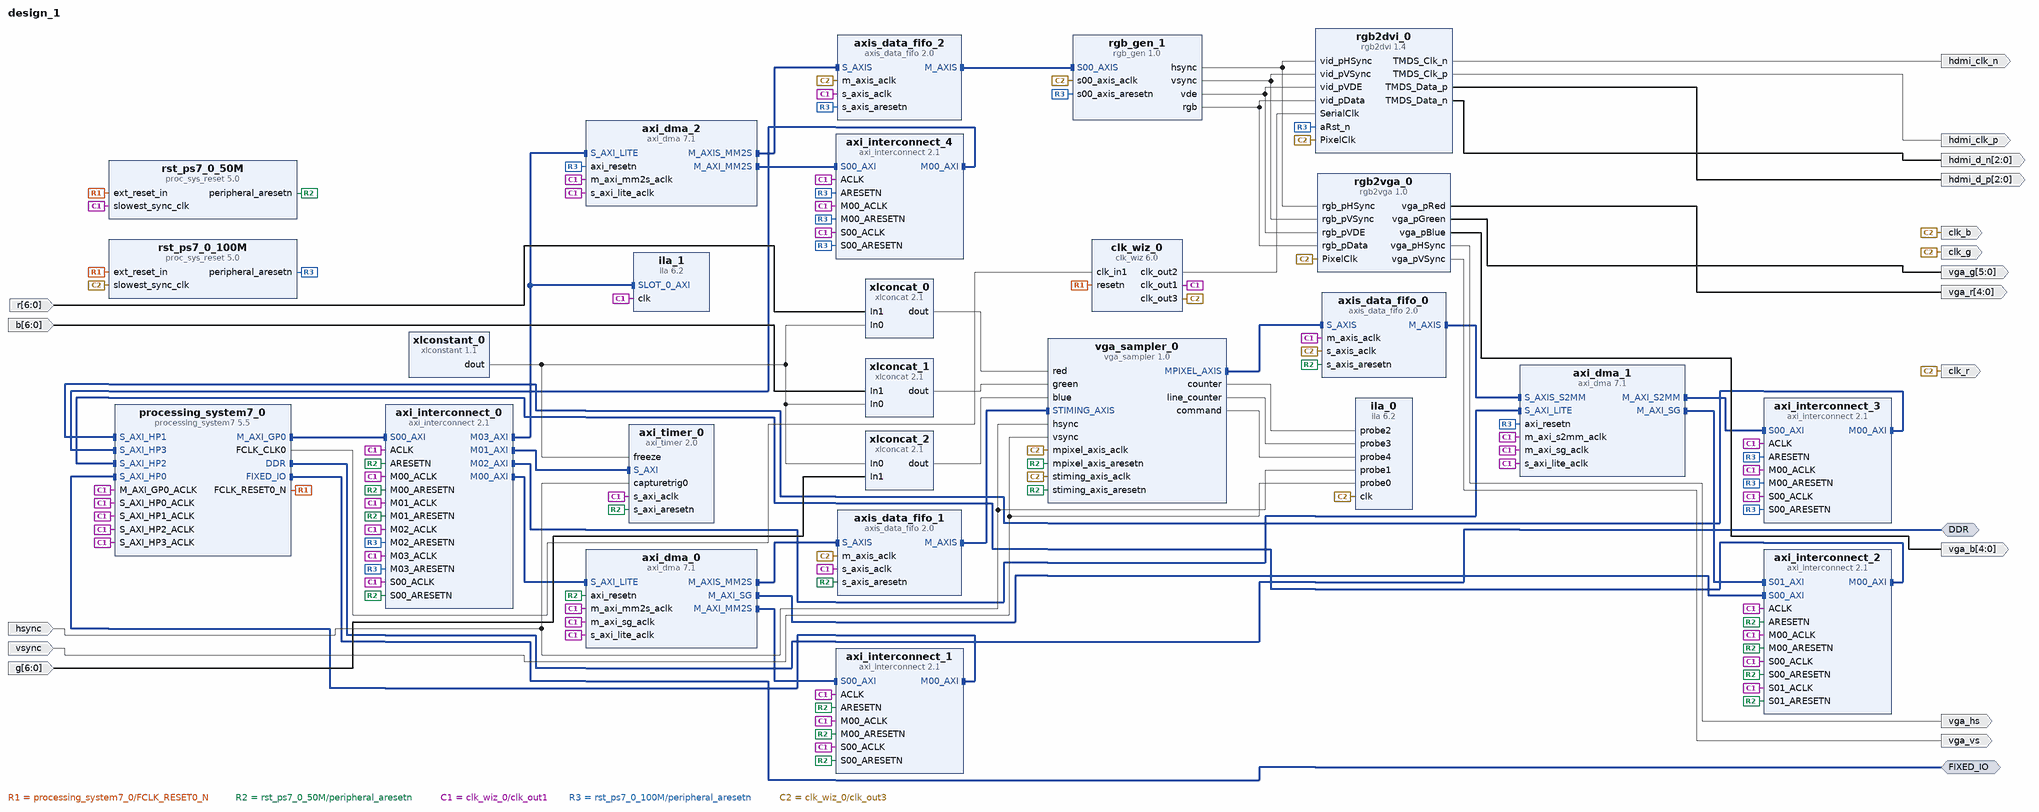
[diagram p0: block diagram of the top level]
# Vivado block design design_1, xc7z010clg400-1, Vivado 2018.3
create_bd_design design_1

create_bd_intf_port -mode Master -vlnv xilinx.com:interface:ddrx_rtl:1.0 DDR
create_bd_intf_port -mode Master -vlnv xilinx.com:display_processing_system7:fixedio_rtl:1.0 FIXED_IO
create_bd_port -dir I hsync
create_bd_port -dir I vsync
create_bd_port -dir I -from 6 -to 0 r
create_bd_port -dir I -from 6 -to 0 g
create_bd_port -dir I -from 6 -to 0 b
create_bd_port -dir O -type clk clk_r
set_property -dict {CONFIG.FREQ_HZ 25000000} [get_bd_ports clk_r]
create_bd_port -dir O -type clk clk_g
set_property -dict {CONFIG.FREQ_HZ 25000000} [get_bd_ports clk_g]
create_bd_port -dir O -type clk clk_b
set_property -dict {CONFIG.FREQ_HZ 25000000} [get_bd_ports clk_b]
create_bd_port -dir O -type clk hdmi_clk_p
create_bd_port -dir O -type clk hdmi_clk_n
create_bd_port -dir O -from 2 -to 0 hdmi_d_p
create_bd_port -dir O -from 2 -to 0 hdmi_d_n
create_bd_port -dir O -from 4 -to 0 vga_r
create_bd_port -dir O -from 5 -to 0 vga_g
create_bd_port -dir O -from 4 -to 0 vga_b
create_bd_port -dir O vga_hs
create_bd_port -dir O vga_vs

create_bd_cell -type ip -vlnv xilinx.com:ip:processing_system7:5.5 processing_system7_0
set_property -dict [list \
  CONFIG.PCW_APU_PERIPHERAL_FREQMHZ 650 \
  CONFIG.PCW_CRYSTAL_PERIPHERAL_FREQMHZ 50.000000 \
  CONFIG.PCW_ENET0_ENET0_IO {MIO 16 .. 27} \
  CONFIG.PCW_ENET0_GRP_MDIO_ENABLE 1 \
  CONFIG.PCW_ENET0_GRP_MDIO_IO {MIO 52 .. 53} \
  CONFIG.PCW_ENET0_PERIPHERAL_ENABLE 1 \
  CONFIG.PCW_ENET0_RESET_ENABLE 0 \
  CONFIG.PCW_ENET_RESET_ENABLE 1 \
  CONFIG.PCW_ENET_RESET_SELECT {Share reset pin} \
  CONFIG.PCW_FPGA0_PERIPHERAL_FREQMHZ 100 \
  CONFIG.PCW_FPGA1_PERIPHERAL_FREQMHZ 50 \
  CONFIG.PCW_GP0_EN_MODIFIABLE_TXN 0 \
  CONFIG.PCW_GP1_EN_MODIFIABLE_TXN 0 \
  CONFIG.PCW_GPIO_MIO_GPIO_ENABLE 1 \
  CONFIG.PCW_GPIO_MIO_GPIO_IO MIO \
  CONFIG.PCW_I2C_RESET_ENABLE 1 \
  CONFIG.PCW_PERIPHERAL_BOARD_PRESET part0 \
  CONFIG.PCW_PRESET_BANK1_VOLTAGE {LVCMOS 1.8V} \
  CONFIG.PCW_QSPI_GRP_FBCLK_ENABLE 1 \
  CONFIG.PCW_QSPI_GRP_FBCLK_IO {MIO 8} \
  CONFIG.PCW_QSPI_GRP_SINGLE_SS_ENABLE 1 \
  CONFIG.PCW_QSPI_GRP_SINGLE_SS_IO {MIO 1 .. 6} \
  CONFIG.PCW_QSPI_PERIPHERAL_ENABLE 1 \
  CONFIG.PCW_QSPI_QSPI_IO {MIO 1 .. 6} \
  CONFIG.PCW_SD0_PERIPHERAL_ENABLE 0 \
  CONFIG.PCW_SINGLE_QSPI_DATA_MODE x4 \
  CONFIG.PCW_UART1_PERIPHERAL_ENABLE 1 \
  CONFIG.PCW_UART1_UART1_IO {MIO 48 .. 49} \
  CONFIG.PCW_UART_PERIPHERAL_FREQMHZ 100 \
  CONFIG.PCW_UIPARAM_DDR_FREQ_MHZ 525 \
  CONFIG.PCW_UIPARAM_DDR_PARTNO {MT41K128M16 JT-125} \
  CONFIG.PCW_USB0_PERIPHERAL_ENABLE 0 \
  CONFIG.PCW_USB_RESET_ENABLE 1 \
  CONFIG.PCW_USE_S_AXI_HP0 1 \
  CONFIG.PCW_USE_S_AXI_HP1 1 \
  CONFIG.PCW_USE_S_AXI_HP2 1 \
  CONFIG.PCW_USE_S_AXI_HP3 1 \
] [get_bd_cells processing_system7_0]
# 492 more settings of processing_system7_0 are not shown: defaults, MIO pin electricals, DDR timing, and values the tool derives
create_bd_cell -type ip -vlnv xilinx.com:ip:axi_dma:7.1 axi_dma_0
set_property -dict [list \
  CONFIG.c_include_mm2s 1 \
  CONFIG.c_include_s2mm 0 \
  CONFIG.c_micro_dma 0 \
  CONFIG.c_sg_include_stscntrl_strm 0 \
  CONFIG.c_sg_length_width 22 \
] [get_bd_cells axi_dma_0]
create_bd_cell -type ip -vlnv xilinx.com:ip:axi_interconnect:2.1 axi_interconnect_0
set_property -dict {CONFIG.ENABLE_ADVANCED_OPTIONS 1 CONFIG.NUM_MI 4} [get_bd_cells axi_interconnect_0]
create_bd_cell -type ip -vlnv xilinx.com:ip:axi_interconnect:2.1 axi_interconnect_1
set_property -dict {CONFIG.NUM_MI 1} [get_bd_cells axi_interconnect_1]
create_bd_cell -type ip -vlnv xilinx.com:ip:axi_interconnect:2.1 axi_interconnect_2
set_property -dict {CONFIG.NUM_MI 1 CONFIG.NUM_SI 2} [get_bd_cells axi_interconnect_2]
create_bd_cell -type ip -vlnv xilinx.com:ip:proc_sys_reset:5.0 rst_ps7_0_50M
create_bd_cell -type ip -vlnv xilinx.com:ip:axis_data_fifo:2.0 axis_data_fifo_0
set_property -dict [list \
  CONFIG.FIFO_DEPTH 4096 \
  CONFIG.HAS_TKEEP 1 \
  CONFIG.HAS_TLAST 1 \
  CONFIG.IS_ACLK_ASYNC 1 \
] [get_bd_cells axis_data_fifo_0]
create_bd_cell -type ip -vlnv xilinx.com:ip:axis_data_fifo:2.0 axis_data_fifo_1
set_property -dict {CONFIG.FIFO_DEPTH 4096 CONFIG.IS_ACLK_ASYNC 1} [get_bd_cells axis_data_fifo_1]
create_bd_cell -type ip -vlnv xilinx.com:ip:axi_timer:2.0 axi_timer_0
set_property -dict {CONFIG.TRIG0_ASSERT Active_Low CONFIG.enable_timer2 0} [get_bd_cells axi_timer_0]
create_bd_cell -type ip -vlnv xilinx.com:ip:xlconstant:1.1 xlconstant_0
set_property -dict {CONFIG.CONST_VAL 0} [get_bd_cells xlconstant_0]
create_bd_cell -type ip -vlnv xilinx.com:ip:xlconcat:2.1 xlconcat_0
set_property -dict {CONFIG.IN0_WIDTH 1 CONFIG.IN1_WIDTH 7} [get_bd_cells xlconcat_0]
create_bd_cell -type ip -vlnv xilinx.com:ip:xlconcat:2.1 xlconcat_1
set_property -dict {CONFIG.IN0_WIDTH 1 CONFIG.IN1_WIDTH 7} [get_bd_cells xlconcat_1]
create_bd_cell -type ip -vlnv xilinx.com:ip:xlconcat:2.1 xlconcat_2
set_property -dict {CONFIG.IN0_WIDTH 1 CONFIG.IN1_WIDTH 7} [get_bd_cells xlconcat_2]
create_bd_cell -type ip -vlnv xilinx.com:ip:clk_wiz:6.0 clk_wiz_0
set_property -dict [list \
  CONFIG.CLKIN1_JITTER_PS 100.0 \
  CONFIG.CLKOUT1_JITTER 151.636 \
  CONFIG.CLKOUT1_PHASE_ERROR 98.575 \
  CONFIG.CLKOUT1_REQUESTED_OUT_FREQ 50.000 \
  CONFIG.CLKOUT2_JITTER 114.829 \
  CONFIG.CLKOUT2_PHASE_ERROR 98.575 \
  CONFIG.CLKOUT2_REQUESTED_OUT_FREQ 200 \
  CONFIG.CLKOUT2_USED true \
  CONFIG.CLKOUT3_JITTER 175.402 \
  CONFIG.CLKOUT3_PHASE_ERROR 98.575 \
  CONFIG.CLKOUT3_REQUESTED_OUT_FREQ 25 \
  CONFIG.CLKOUT3_USED true \
  CONFIG.CLK_IN1_BOARD_INTERFACE Custom \
  CONFIG.CLK_IN2_BOARD_INTERFACE Custom \
  CONFIG.MMCM_CLKFBOUT_MULT_F 10.000 \
  CONFIG.MMCM_CLKIN1_PERIOD 10.000 \
  CONFIG.MMCM_CLKIN2_PERIOD 10.000 \
  CONFIG.MMCM_CLKOUT0_DIVIDE_F 20.000 \
  CONFIG.MMCM_CLKOUT1_DIVIDE 5 \
  CONFIG.MMCM_CLKOUT2_DIVIDE 40 \
  CONFIG.MMCM_DIVCLK_DIVIDE 1 \
  CONFIG.NUM_OUT_CLKS 3 \
  CONFIG.PRIM_IN_FREQ 100.000 \
  CONFIG.RESET_BOARD_INTERFACE Custom \
  CONFIG.RESET_PORT resetn \
  CONFIG.RESET_TYPE ACTIVE_LOW \
  CONFIG.USE_BOARD_FLOW true \
  CONFIG.USE_LOCKED false \
] [get_bd_cells clk_wiz_0]
create_bd_cell -type ip -vlnv xilinx.com:ip:axi_dma:7.1 axi_dma_1
set_property -dict [list \
  CONFIG.c_include_mm2s 0 \
  CONFIG.c_micro_dma 0 \
  CONFIG.c_sg_include_stscntrl_strm 0 \
  CONFIG.c_sg_length_width 22 \
] [get_bd_cells axi_dma_1]
create_bd_cell -type ip -vlnv xilinx.com:ip:axi_interconnect:2.1 axi_interconnect_3
set_property -dict {CONFIG.NUM_MI 1} [get_bd_cells axi_interconnect_3]
create_bd_cell -type ip -vlnv xilinx.com:ip:proc_sys_reset:5.0 rst_ps7_0_100M
create_bd_cell -type ip -vlnv xilinx.com:ip:axi_dma:7.1 axi_dma_2
set_property -dict [list \
  CONFIG.c_include_mm2s 1 \
  CONFIG.c_include_s2mm 0 \
  CONFIG.c_include_sg 0 \
  CONFIG.c_sg_length_width 20 \
] [get_bd_cells axi_dma_2]
create_bd_cell -type ip -vlnv xilinx.com:ip:axi_interconnect:2.1 axi_interconnect_4
set_property -dict {CONFIG.NUM_MI 1} [get_bd_cells axi_interconnect_4]
create_bd_cell -type ip -vlnv xilinx.com:ip:axis_data_fifo:2.0 axis_data_fifo_2
set_property -dict [list \
  CONFIG.FIFO_DEPTH 2048 \
  CONFIG.HAS_TKEEP 0 \
  CONFIG.HAS_TLAST 0 \
  CONFIG.HAS_TSTRB 0 \
  CONFIG.IS_ACLK_ASYNC 1 \
] [get_bd_cells axis_data_fifo_2]
create_bd_cell -type ip -vlnv digilentinc.com:ip:rgb2dvi:1.4 rgb2dvi_0
set_property -dict {CONFIG.kGenerateSerialClk false CONFIG.kRstActiveHigh false} [get_bd_cells rgb2dvi_0]
create_bd_cell -type ip -vlnv xilinx.com:ip:ila:6.2 ila_1
set_property -dict {CONFIG.C_DATA_DEPTH 2048} [get_bd_cells ila_1]
create_bd_cell -type ip -vlnv user.org:user:rgb_gen:1.0 rgb_gen_1
create_bd_cell -type ip -vlnv xilinx.com:ip:ila:6.2 ila_0
set_property -dict [list \
  CONFIG.ALL_PROBE_SAME_MU_CNT 2 \
  CONFIG.C_DATA_DEPTH 16384 \
  CONFIG.C_ENABLE_ILA_AXI_MON false \
  CONFIG.C_EN_STRG_QUAL 1 \
  CONFIG.C_MONITOR_TYPE Native \
  CONFIG.C_NUM_OF_PROBES 5 \
  CONFIG.C_PROBE0_MU_CNT 2 \
  CONFIG.C_PROBE1_MU_CNT 2 \
  CONFIG.C_PROBE2_MU_CNT 2 \
  CONFIG.C_PROBE2_WIDTH 31 \
  CONFIG.C_PROBE3_WIDTH 16 \
  CONFIG.C_PROBE4_WIDTH 32 \
] [get_bd_cells ila_0]
create_bd_cell -type ip -vlnv user.org:user:vga_sampler:1.0 vga_sampler_0
create_bd_cell -type ip -vlnv digilentinc.com:ip:rgb2vga:1.0 rgb2vga_0

# ---- connections ----

connect_bd_intf_net [get_bd_intf_pins vga_sampler_0/MPIXEL_AXIS] [get_bd_intf_pins axis_data_fifo_0/S_AXIS]
connect_bd_intf_net [get_bd_intf_pins rgb_gen_1/S00_AXIS] [get_bd_intf_pins axis_data_fifo_2/M_AXIS]
connect_bd_intf_net [get_bd_intf_pins axis_data_fifo_1/M_AXIS] [get_bd_intf_pins vga_sampler_0/STIMING_AXIS]
connect_bd_intf_net [get_bd_intf_ports DDR] [get_bd_intf_pins processing_system7_0/DDR]
connect_bd_intf_net [get_bd_intf_pins axi_interconnect_0/M00_AXI] [get_bd_intf_pins axi_dma_0/S_AXI_LITE]
connect_bd_intf_net [get_bd_intf_pins axi_interconnect_3/M00_AXI] [get_bd_intf_pins processing_system7_0/S_AXI_HP1]
connect_bd_intf_net [get_bd_intf_pins axi_interconnect_4/M00_AXI] [get_bd_intf_pins processing_system7_0/S_AXI_HP3]
connect_bd_intf_net [get_bd_intf_pins axi_interconnect_0/M03_AXI] [get_bd_intf_pins axi_dma_2/S_AXI_LITE]
connect_bd_intf_net [get_bd_intf_pins axi_interconnect_0/M03_AXI] [get_bd_intf_pins ila_1/SLOT_0_AXI]
connect_bd_intf_net [get_bd_intf_pins axi_dma_0/M_AXI_SG] [get_bd_intf_pins axi_interconnect_2/S00_AXI]
connect_bd_intf_net [get_bd_intf_pins axis_data_fifo_0/M_AXIS] [get_bd_intf_pins axi_dma_1/S_AXIS_S2MM]
connect_bd_intf_net -intf_net S00_AXI_2 [get_bd_intf_pins axi_interconnect_2/S01_AXI] [get_bd_intf_pins axi_dma_1/M_AXI_SG]
connect_bd_intf_net [get_bd_intf_pins axi_dma_2/M_AXI_MM2S] [get_bd_intf_pins axi_interconnect_4/S00_AXI]
connect_bd_intf_net [get_bd_intf_ports FIXED_IO] [get_bd_intf_pins processing_system7_0/FIXED_IO]
connect_bd_intf_net [get_bd_intf_pins axis_data_fifo_2/S_AXIS] [get_bd_intf_pins axi_dma_2/M_AXIS_MM2S]
connect_bd_intf_net [get_bd_intf_pins axi_interconnect_3/S00_AXI] [get_bd_intf_pins axi_dma_1/M_AXI_S2MM]
connect_bd_intf_net [get_bd_intf_pins axi_timer_0/S_AXI] [get_bd_intf_pins axi_interconnect_0/M01_AXI]
connect_bd_intf_net [get_bd_intf_pins axis_data_fifo_1/S_AXIS] [get_bd_intf_pins axi_dma_0/M_AXIS_MM2S]
connect_bd_intf_net [get_bd_intf_pins axi_dma_0/M_AXI_MM2S] [get_bd_intf_pins axi_interconnect_1/S00_AXI]
connect_bd_intf_net [get_bd_intf_pins axi_dma_1/S_AXI_LITE] [get_bd_intf_pins axi_interconnect_0/M02_AXI]
connect_bd_intf_net [get_bd_intf_pins processing_system7_0/M_AXI_GP0] [get_bd_intf_pins axi_interconnect_0/S00_AXI]
connect_bd_intf_net [get_bd_intf_pins axi_interconnect_1/M00_AXI] [get_bd_intf_pins processing_system7_0/S_AXI_HP0]
connect_bd_intf_net [get_bd_intf_pins axi_interconnect_2/M00_AXI] [get_bd_intf_pins processing_system7_0/S_AXI_HP2]
connect_bd_net [get_bd_pins processing_system7_0/FCLK_RESET0_N] \
  [get_bd_pins rst_ps7_0_50M/ext_reset_in] [get_bd_pins clk_wiz_0/resetn] [get_bd_pins rst_ps7_0_100M/ext_reset_in]
connect_bd_net [get_bd_pins rst_ps7_0_50M/peripheral_aresetn] \
  [get_bd_pins axi_interconnect_0/S00_ARESETN] [get_bd_pins axi_interconnect_2/M00_ARESETN] \
  [get_bd_pins axi_interconnect_1/M00_ARESETN] [get_bd_pins axi_dma_0/axi_resetn] \
  [get_bd_pins axi_interconnect_0/M00_ARESETN] [get_bd_pins axi_interconnect_1/S00_ARESETN] \
  [get_bd_pins axi_interconnect_2/S00_ARESETN] [get_bd_pins axi_interconnect_0/ARESETN] \
  [get_bd_pins axi_interconnect_1/ARESETN] [get_bd_pins axi_interconnect_2/ARESETN] \
  [get_bd_pins axi_interconnect_0/M01_ARESETN] [get_bd_pins axi_timer_0/s_axi_aresetn] \
  [get_bd_pins axi_interconnect_2/S01_ARESETN] [get_bd_pins axis_data_fifo_1/s_axis_aresetn] \
  [get_bd_pins axis_data_fifo_0/s_axis_aresetn] [get_bd_pins vga_sampler_0/stiming_axis_aresetn] \
  [get_bd_pins vga_sampler_0/mpixel_axis_aresetn]
connect_bd_net -net hsync_0_1 [get_bd_ports hsync] [get_bd_pins axi_timer_0/capturetrig0] [get_bd_pins ila_0/probe1] [get_bd_pins vga_sampler_0/hsync]
connect_bd_net -net vsync_0_1 [get_bd_ports vsync] [get_bd_pins ila_0/probe0] [get_bd_pins vga_sampler_0/vsync]
connect_bd_net [get_bd_pins xlconstant_0/dout] \
  [get_bd_pins axi_timer_0/freeze] [get_bd_pins xlconcat_0/In0] [get_bd_pins xlconcat_1/In0] [get_bd_pins xlconcat_2/In0]
connect_bd_net -net In1_0_1 [get_bd_ports r] [get_bd_pins xlconcat_0/In1]
connect_bd_net [get_bd_pins xlconcat_2/dout] [get_bd_pins vga_sampler_0/blue]
connect_bd_net [get_bd_pins xlconcat_1/dout] [get_bd_pins vga_sampler_0/green]
connect_bd_net [get_bd_pins xlconcat_0/dout] [get_bd_pins vga_sampler_0/red]
connect_bd_net -net processing_system7_0_FCLK_CLK0 [get_bd_pins clk_wiz_0/clk_out1] \
  [get_bd_pins processing_system7_0/M_AXI_GP0_ACLK] [get_bd_pins axi_interconnect_0/S00_ACLK] \
  [get_bd_pins axi_interconnect_2/M00_ACLK] [get_bd_pins processing_system7_0/S_AXI_HP0_ACLK] \
  [get_bd_pins axi_interconnect_1/M00_ACLK] [get_bd_pins axi_dma_0/s_axi_lite_aclk] [get_bd_pins axi_interconnect_0/M00_ACLK] \
  [get_bd_pins axi_interconnect_1/S00_ACLK] [get_bd_pins axi_dma_0/m_axi_sg_aclk] [get_bd_pins axi_interconnect_2/S00_ACLK] \
  [get_bd_pins axi_dma_0/m_axi_mm2s_aclk] [get_bd_pins axis_data_fifo_1/s_axis_aclk] [get_bd_pins axi_interconnect_0/ACLK] \
  [get_bd_pins axi_interconnect_0/M01_ACLK] [get_bd_pins axi_timer_0/s_axi_aclk] [get_bd_pins axi_interconnect_1/ACLK] \
  [get_bd_pins axi_interconnect_2/ACLK] [get_bd_pins rst_ps7_0_50M/slowest_sync_clk] \
  [get_bd_pins axi_interconnect_0/M02_ACLK] [get_bd_pins axi_interconnect_3/M00_ACLK] \
  [get_bd_pins axi_interconnect_3/S00_ACLK] [get_bd_pins axi_interconnect_3/ACLK] \
  [get_bd_pins processing_system7_0/S_AXI_HP1_ACLK] [get_bd_pins axi_dma_1/s_axi_lite_aclk] \
  [get_bd_pins axi_dma_1/m_axi_sg_aclk] [get_bd_pins axi_dma_1/m_axi_s2mm_aclk] [get_bd_pins axi_interconnect_2/S01_ACLK] \
  [get_bd_pins axi_dma_2/m_axi_mm2s_aclk] [get_bd_pins axi_dma_2/s_axi_lite_aclk] [get_bd_pins axis_data_fifo_2/s_axis_aclk] \
  [get_bd_pins processing_system7_0/S_AXI_HP2_ACLK] [get_bd_pins processing_system7_0/S_AXI_HP3_ACLK] \
  [get_bd_pins axi_interconnect_4/S00_ACLK] [get_bd_pins axi_interconnect_4/M00_ACLK] [get_bd_pins axi_interconnect_4/ACLK] \
  [get_bd_pins axi_interconnect_0/M03_ACLK] [get_bd_pins ila_1/clk] [get_bd_pins axis_data_fifo_0/m_axis_aclk]
connect_bd_net [get_bd_pins rst_ps7_0_100M/peripheral_aresetn] \
  [get_bd_pins axi_interconnect_3/M00_ARESETN] [get_bd_pins axi_interconnect_0/M02_ARESETN] \
  [get_bd_pins axi_dma_1/axi_resetn] [get_bd_pins axi_interconnect_3/S00_ARESETN] [get_bd_pins axi_interconnect_3/ARESETN] \
  [get_bd_pins axi_dma_2/axi_resetn] [get_bd_pins axis_data_fifo_2/s_axis_aresetn] [get_bd_pins axi_interconnect_4/ARESETN] \
  [get_bd_pins axi_interconnect_4/S00_ARESETN] [get_bd_pins axi_interconnect_4/M00_ARESETN] \
  [get_bd_pins axi_interconnect_0/M03_ARESETN] [get_bd_pins rgb2dvi_0/aRst_n] [get_bd_pins rgb_gen_1/s00_axis_aresetn]
connect_bd_net [get_bd_pins processing_system7_0/FCLK_CLK0] [get_bd_pins clk_wiz_0/clk_in1]
connect_bd_net [get_bd_pins clk_wiz_0/clk_out2] [get_bd_pins rgb2dvi_0/SerialClk]
connect_bd_net -net rgb_gen_0_hsync [get_bd_pins rgb_gen_1/hsync] [get_bd_pins rgb2dvi_0/vid_pHSync] [get_bd_pins rgb2vga_0/rgb_pHSync]
connect_bd_net -net rgb_gen_0_vsync [get_bd_pins rgb_gen_1/vsync] [get_bd_pins rgb2dvi_0/vid_pVSync] [get_bd_pins rgb2vga_0/rgb_pVSync]
connect_bd_net -net rgb_gen_0_vde [get_bd_pins rgb_gen_1/vde] [get_bd_pins rgb2dvi_0/vid_pVDE] [get_bd_pins rgb2vga_0/rgb_pVDE]
connect_bd_net [get_bd_pins rgb2dvi_0/TMDS_Clk_p] [get_bd_ports hdmi_clk_p]
connect_bd_net [get_bd_pins rgb2dvi_0/TMDS_Clk_n] [get_bd_ports hdmi_clk_n]
connect_bd_net [get_bd_pins rgb2dvi_0/TMDS_Data_p] [get_bd_ports hdmi_d_p]
connect_bd_net [get_bd_pins rgb2dvi_0/TMDS_Data_n] [get_bd_ports hdmi_d_n]
connect_bd_net [get_bd_pins rgb_gen_1/rgb] [get_bd_pins rgb2dvi_0/vid_pData] [get_bd_pins rgb2vga_0/rgb_pData]
connect_bd_net [get_bd_pins clk_wiz_0/clk_out3] \
  [get_bd_pins rst_ps7_0_100M/slowest_sync_clk] [get_bd_pins axis_data_fifo_2/m_axis_aclk] [get_bd_pins rgb2dvi_0/PixelClk] \
  [get_bd_pins rgb_gen_1/s00_axis_aclk] [get_bd_pins axis_data_fifo_0/s_axis_aclk] [get_bd_pins axis_data_fifo_1/m_axis_aclk] \
  [get_bd_ports clk_b] [get_bd_ports clk_g] [get_bd_ports clk_r] [get_bd_pins ila_0/clk] \
  [get_bd_pins vga_sampler_0/stiming_axis_aclk] [get_bd_pins vga_sampler_0/mpixel_axis_aclk] [get_bd_pins rgb2vga_0/PixelClk]
connect_bd_net [get_bd_pins vga_sampler_0/counter] [get_bd_pins ila_0/probe2]
connect_bd_net [get_bd_pins vga_sampler_0/line_counter] [get_bd_pins ila_0/probe3]
connect_bd_net [get_bd_pins vga_sampler_0/command] [get_bd_pins ila_0/probe4]
connect_bd_net [get_bd_ports b] [get_bd_pins xlconcat_1/In1]
connect_bd_net [get_bd_ports g] [get_bd_pins xlconcat_2/In1]
connect_bd_net [get_bd_pins rgb2vga_0/vga_pRed] [get_bd_ports vga_r]
connect_bd_net [get_bd_pins rgb2vga_0/vga_pGreen] [get_bd_ports vga_g]
connect_bd_net [get_bd_pins rgb2vga_0/vga_pBlue] [get_bd_ports vga_b]
connect_bd_net [get_bd_pins rgb2vga_0/vga_pHSync] [get_bd_ports vga_hs]
connect_bd_net [get_bd_pins rgb2vga_0/vga_pVSync] [get_bd_ports vga_vs]

# ---- address map ----
assign_bd_address -offset 0x00000000 -range 512M -target_address_space [get_bd_addr_spaces axi_dma_0/Data_MM2S] [get_bd_addr_segs processing_system7_0/S_AXI_HP0/HP0_DDR_LOWOCM]
assign_bd_address -offset 0x00000000 -range 512M -target_address_space [get_bd_addr_spaces axi_dma_0/Data_SG] [get_bd_addr_segs processing_system7_0/S_AXI_HP2/HP2_DDR_LOWOCM]
assign_bd_address -offset 0x00000000 -range 512M -target_address_space [get_bd_addr_spaces axi_dma_1/Data_S2MM] [get_bd_addr_segs processing_system7_0/S_AXI_HP1/HP1_DDR_LOWOCM]
assign_bd_address -offset 0x00000000 -range 512M -target_address_space [get_bd_addr_spaces axi_dma_1/Data_SG] [get_bd_addr_segs processing_system7_0/S_AXI_HP2/HP2_DDR_LOWOCM]
assign_bd_address -offset 0x00000000 -range 512M -target_address_space [get_bd_addr_spaces axi_dma_2/Data_MM2S] [get_bd_addr_segs processing_system7_0/S_AXI_HP3/HP3_DDR_LOWOCM]
assign_bd_address -offset 0x40400000 -range 64K -target_address_space [get_bd_addr_spaces processing_system7_0/Data] [get_bd_addr_segs axi_dma_0/S_AXI_LITE/Reg]
assign_bd_address -offset 0x40410000 -range 64K -target_address_space [get_bd_addr_spaces processing_system7_0/Data] [get_bd_addr_segs axi_dma_1/S_AXI_LITE/Reg]
assign_bd_address -offset 0x40420000 -range 64K -target_address_space [get_bd_addr_spaces processing_system7_0/Data] [get_bd_addr_segs axi_dma_2/S_AXI_LITE/Reg]
assign_bd_address -offset 0x42800000 -range 64K -target_address_space [get_bd_addr_spaces processing_system7_0/Data] [get_bd_addr_segs axi_timer_0/S_AXI/Reg]

validate_bd_design
save_bd_design
